# Altium schematic sheet SHDN-S01-V00-ShutdownBoard.SchDoc: Shutdown Board 2020
size A3; DrawnBy: Jonn Dillon; DocumentNumber: 1; Revision: 00; SheetNumber: 1; SheetTotal: 11; Project: Shutdown Board 2020; Version: 00
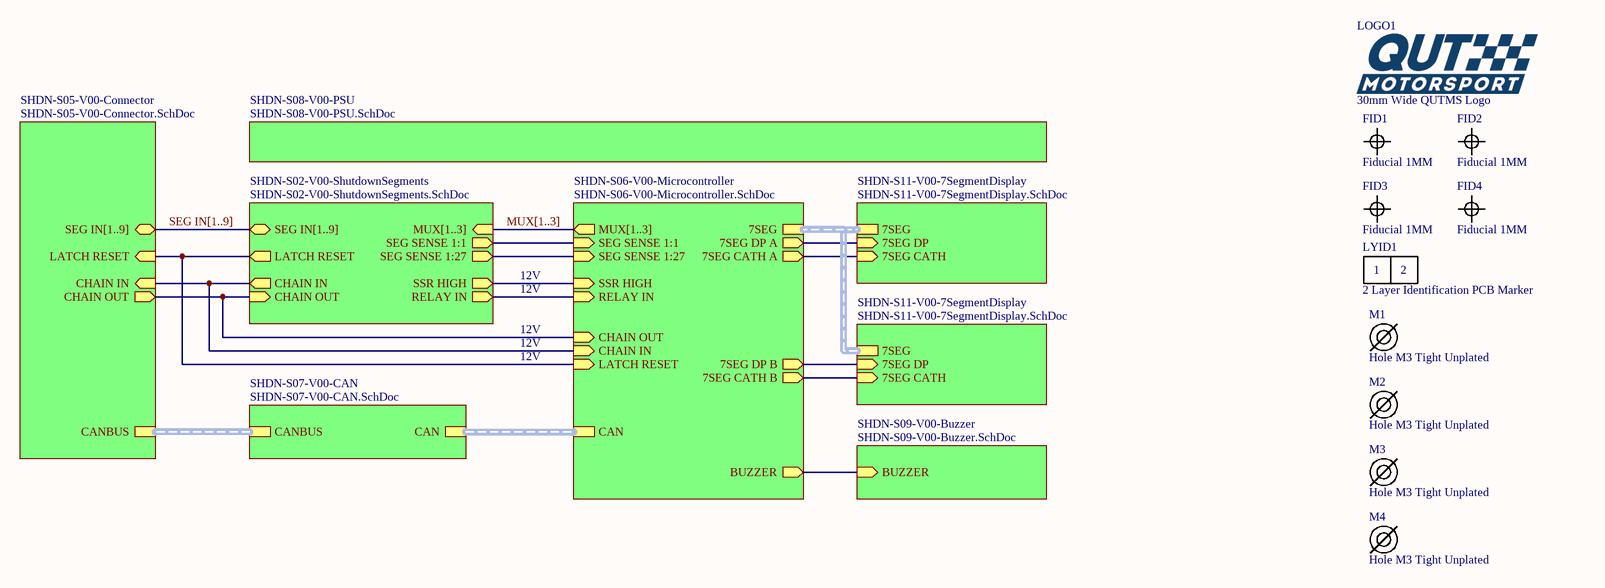
[diagram p0: SHDN-S01-V00-ShutdownBoard.SchDoc]

## Parts
FID1  Fiducial 1MM  [FIDUCIAL 1MM]
FID2  Fiducial 1MM  [FIDUCIAL 1MM]
FID3  Fiducial 1MM  [FIDUCIAL 1MM]
FID4  Fiducial 1MM  [FIDUCIAL 1MM]
LOGO1  30mm Wide QUTMS Logo  [QUTMS LOGO 30MM]
LYID1  2 Layer Identification PCB Marker  [LAYER IDENT 2]
M1  Hole M3 Tight Unplated  [M3.2 UNPLATED]
M2  Hole M3 Tight Unplated  [M3.2 UNPLATED]
M3  Hole M3 Tight Unplated  [M3.2 UNPLATED]
M4  Hole M3 Tight Unplated  [M3.2 UNPLATED]

## Sub-sheets
SHDN-S02-V00-ShutdownSegments = SHDN-S02-V00-ShutdownSegments.SchDoc: SEG IN[1..9] (bidir), LATCH RESET (out), CHAIN IN (out), CHAIN OUT (in), MUX[1..3] (in), RELAY IN (out), SSR HIGH (out), SEG SENSE 1:1 (out), SEG SENSE 1:27 (out)
SHDN-S05-V00-Connector = SHDN-S05-V00-Connector.SchDoc: SEG IN[1..9] (bidir), CANBUS (harness CANBUS), CHAIN OUT (out), CHAIN IN (in), LATCH RESET (in)
SHDN-S06-V00-Microcontroller = SHDN-S06-V00-Microcontroller.SchDoc: BUZZER (out), CAN (harness CAN), MUX[1..3] (out), 7SEG (harness 7SEG), 7SEG DP A (out), 7SEG CATH A (out), 7SEG DP B (out), 7SEG CATH B (out), SSR HIGH (in), RELAY IN (in), CHAIN OUT (in), CHAIN IN (in), LATCH RESET (in), SEG SENSE 1:1 (in), SEG SENSE 1:27 (in)
SHDN-S07-V00-CAN = SHDN-S07-V00-CAN.SchDoc: CAN (harness CAN), CANBUS (harness CANBUS)
SHDN-S08-V00-PSU = SHDN-S08-V00-PSU.SchDoc: no entries
SHDN-S09-V00-Buzzer = SHDN-S09-V00-Buzzer.SchDoc: BUZZER (in)
SHDN-S11-V00-7SegmentDisplay = SHDN-S11-V00-7SegmentDisplay.SchDoc: 7SEG (harness 7SEG), 7SEG CATH (in), 7SEG DP (in)
SHDN-S11-V00-7SegmentDisplay = SHDN-S11-V00-7SegmentDisplay.SchDoc: 7SEG (harness 7SEG), 7SEG CATH (in), 7SEG DP (in)

## Nets
(unnamed): sheet SHDN-S02-V00-ShutdownSegments/LATCH RESET, sheet SHDN-S06-V00-Microcontroller/LATCH RESET, sheet SHDN-S05-V00-Connector/LATCH RESET
(unnamed): sheet SHDN-S02-V00-ShutdownSegments/CHAIN IN, sheet SHDN-S06-V00-Microcontroller/CHAIN IN, sheet SHDN-S05-V00-Connector/CHAIN IN
(unnamed): sheet SHDN-S02-V00-ShutdownSegments/CHAIN OUT, sheet SHDN-S06-V00-Microcontroller/CHAIN OUT, sheet SHDN-S05-V00-Connector/CHAIN OUT
(unnamed): sheet SHDN-S02-V00-ShutdownSegments/RELAY IN, sheet SHDN-S06-V00-Microcontroller/RELAY IN
(unnamed): sheet SHDN-S02-V00-ShutdownSegments/SSR HIGH, sheet SHDN-S06-V00-Microcontroller/SSR HIGH
(unnamed): sheet SHDN-S02-V00-ShutdownSegments/SEG SENSE 1:1, sheet SHDN-S06-V00-Microcontroller/SEG SENSE 1:1
(unnamed): sheet SHDN-S02-V00-ShutdownSegments/SEG SENSE 1:27, sheet SHDN-S06-V00-Microcontroller/SEG SENSE 1:27
(unnamed): sheet SHDN-S06-V00-Microcontroller/BUZZER, sheet SHDN-S09-V00-Buzzer/BUZZER
(unnamed): sheet SHDN-S06-V00-Microcontroller/7SEG DP A, sheet SHDN-S11-V00-7SegmentDisplay/7SEG DP
(unnamed): sheet SHDN-S06-V00-Microcontroller/7SEG CATH A, sheet SHDN-S11-V00-7SegmentDisplay/7SEG CATH
(unnamed): sheet SHDN-S06-V00-Microcontroller/7SEG DP B, sheet SHDN-S11-V00-7SegmentDisplay/7SEG DP
(unnamed): sheet SHDN-S06-V00-Microcontroller/7SEG CATH B, sheet SHDN-S11-V00-7SegmentDisplay/7SEG CATH

## Buses and harness runs
bus MUX[1..3] = sheet SHDN-S02-V00-ShutdownSegments/MUX[1..3] = sheet SHDN-S06-V00-Microcontroller/MUX[1..3]
bus SEG IN[1..9] = sheet SHDN-S02-V00-ShutdownSegments/SEG IN[1..9] = sheet SHDN-S05-V00-Connector/SEG IN[1..9]
harness sheet SHDN-S05-V00-Connector/CANBUS = sheet SHDN-S07-V00-CAN/CANBUS
harness sheet SHDN-S06-V00-Microcontroller/7SEG = sheet SHDN-S11-V00-7SegmentDisplay/7SEG
harness sheet SHDN-S06-V00-Microcontroller/CAN = sheet SHDN-S07-V00-CAN/CAN

## Notes on the sheet
- 12V
- Revision History:
- Sheet Title:
- Rev
- Date
- Description
- Project:
- Size:
- Drawn By:
- A3
- Number:
- Revision:
- Sheet
- Version:
- of
- QUT Motorsport
- O-120, Gardens Point
- 2 George Street
- Brisbane, QLD 4000
- Australia
- Print Date:
- Print Time:
- File Name:
- (in symbol Layer Identification 2) 1; 2

## Library data of the parts
LOGO1 = QUTMS Logo 30mm
LYID1 = Layer Identification 2
M1-M4 = Hole M3 Tight Unplated: M3.2 Hole, No Plating